# EAGLE schematic CheetahBooster (EAGLE 7.6.0)
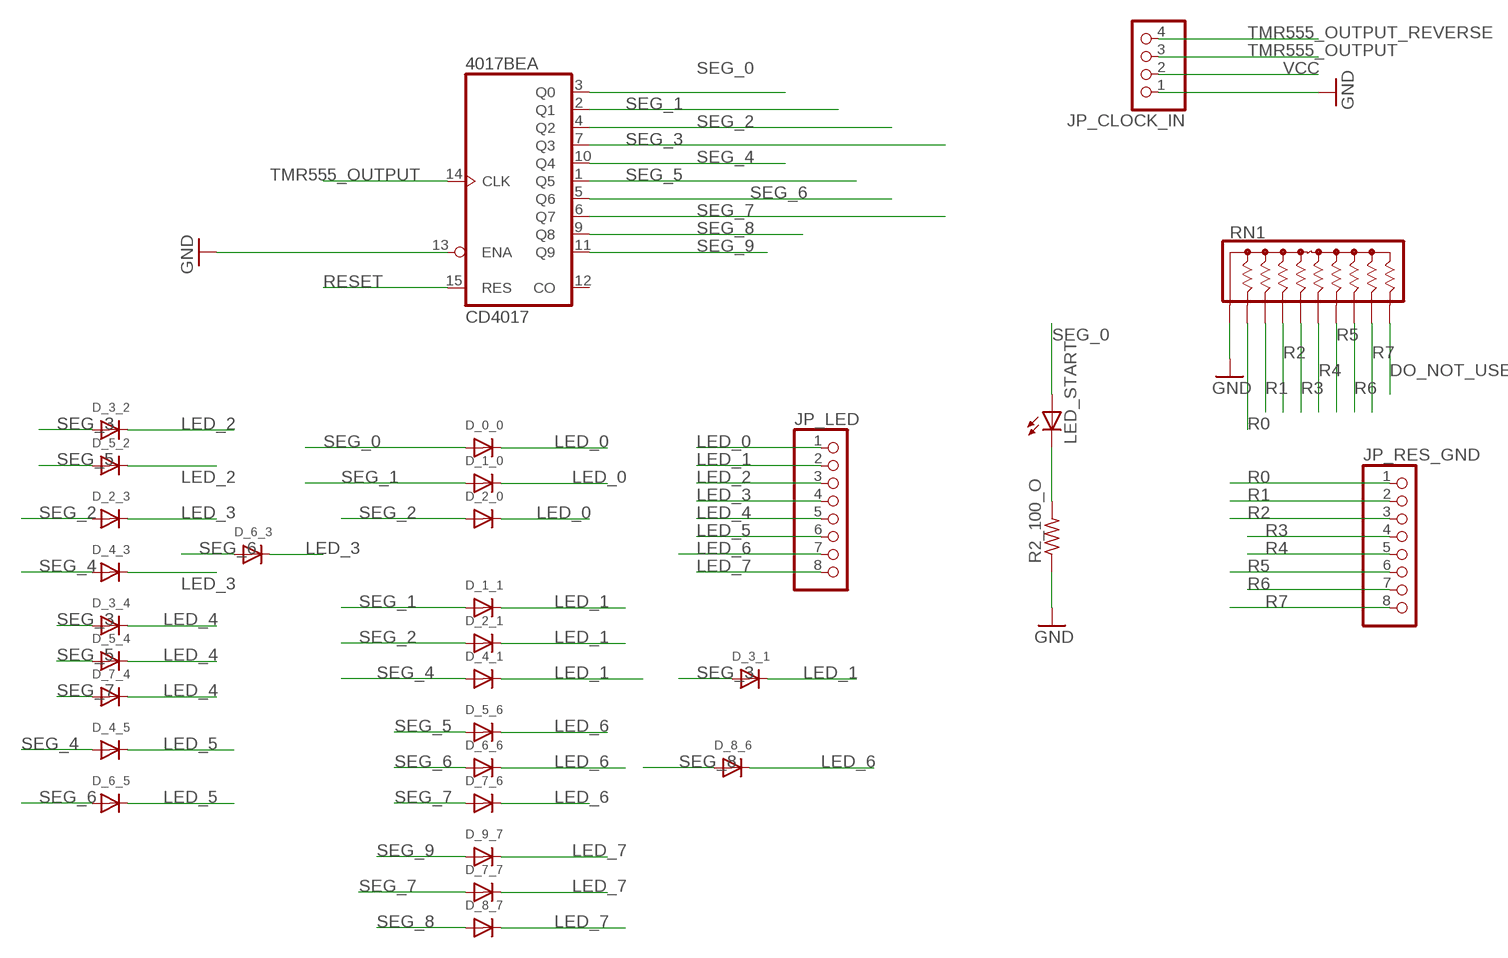
[diagram p0: schematic, sheet 1]

## Parts
4017BE  CD4017  [DIL16]
D_0_0  DIODESMA  [SMADIODE]
D_1_0  DIODESMA  [SMADIODE]
D_1_1  DIODESMA  [SMADIODE]
D_2_0  DIODESMA  [SMADIODE]
D_2_1  DIODESMA  [SMADIODE]
D_2_3  DIODESMA  [SMADIODE]
D_3_1  DIODESMA  [SMADIODE]
D_3_2  DIODESMA  [SMADIODE]
D_3_4  DIODESMA  [SMADIODE]
D_4_1  DIODESMA  [SMADIODE]
D_4_3  DIODESMA  [SMADIODE]
D_4_5  DIODESMA  [SMADIODE]
D_5_2  DIODESMA  [SMADIODE]
D_5_4  DIODESMA  [SMADIODE]
D_5_6  DIODESMA  [SMADIODE]
D_6_3  DIODESMA  [SMADIODE]
D_6_5  DIODESMA  [SMADIODE]
D_6_6  DIODESMA  [SMADIODE]
D_7_4  DIODESMA  [SMADIODE]
D_7_6  DIODESMA  [SMADIODE]
D_7_7  DIODESMA  [SMADIODE]
D_8_6  DIODESMA  [SMADIODE]
D_8_7  DIODESMA  [SMADIODE]
D_9_7  DIODESMA  [SMADIODE]
JP_CLOCK_IN  PINHD-1X4  [1X04]
JP_LED  PINHD-1X8  [1X08]
JP_RES_GND  PINHD-1X8  [1X08]
LED_START  LEDSMT1206  [1206]
R2_100_O  R-US_R1206  [R1206]
RN1  4610X  [SIP10]

## Nets
DO_NOT_USE: RN1.10
GND: 4017BE.13(A:ENA) JP_CLOCK_IN.1 R2_100_O.1 RN1.1
LED_0: D_0_0.C D_1_0.C D_2_0.C JP_LED.1
LED_1: D_1_1.C D_2_1.C D_3_1.C D_4_1.C JP_LED.2
LED_2: D_3_2.C D_5_2.C JP_LED.3
LED_3: D_2_3.C D_4_3.C D_6_3.C JP_LED.4
LED_4: D_3_4.C D_5_4.C D_7_4.C JP_LED.5
LED_5: D_4_5.C D_6_5.C JP_LED.6
LED_6: D_5_6.C D_6_6.C D_7_6.C D_8_6.C JP_LED.7
LED_7: D_7_7.C D_8_7.C D_9_7.C JP_LED.8
N$1: LED_START.C R2_100_O.2
R0: JP_RES_GND.1 RN1.2
R1: JP_RES_GND.2 RN1.3
R2: JP_RES_GND.3 RN1.4
R3: JP_RES_GND.4 RN1.5
R4: JP_RES_GND.5 RN1.6
R5: JP_RES_GND.6 RN1.7
R6: JP_RES_GND.7 RN1.8
R7: JP_RES_GND.8 RN1.9
RESET: 4017BE.15(A:RES)
SEG_0: 4017BE.3(A:Q0) D_0_0.A LED_START.A
SEG_1: 4017BE.2(A:Q1) D_1_0.A D_1_1.A
SEG_2: 4017BE.4(A:Q2) D_2_0.A D_2_1.A D_2_3.A
SEG_3: 4017BE.7(A:Q3) D_3_1.A D_3_2.A D_3_4.A
SEG_4: 4017BE.10(A:Q4) D_4_1.A D_4_3.A D_4_5.A
SEG_5: 4017BE.1(A:Q5) D_5_2.A D_5_4.A D_5_6.A
SEG_6: 4017BE.5(A:Q6) D_6_3.A D_6_5.A D_6_6.A
SEG_7: 4017BE.6(A:Q7) D_7_4.A D_7_6.A D_7_7.A
SEG_8: 4017BE.9(A:Q8) D_8_6.A D_8_7.A
SEG_9: 4017BE.11(A:Q9) D_9_7.A
TMR555_OUTPUT: 4017BE.14(A:CLK) JP_CLOCK_IN.3
TMR555_OUTPUT_REVERSE: JP_CLOCK_IN.4
VCC: JP_CLOCK_IN.2
Unconnected: 4017BE.12(A:CO)

## Power pins joined to a net without a drawn wire
GND: 4017BE.8(P:GND)
VCC: 4017BE.16(P:VCC)

## Library data of the parts
4017BE = SparkFun-DigitalIC:CD4017; PROD_ID: IC-11929
D_0_0 D_1_0 D_1_1 D_2_0 D_2_1 D_2_3 D_3_1 D_3_2 D_3_4 D_4_1 D_4_3 D_4_5 D_5_2 D_5_4 D_5_6 D_6_3 D_6_5 D_6_6 D_7_4 D_7_6 D_7_7 D_8_6 D_8_7 D_9_7 = adafruit:DIODE: Diode SMADIODE - SMA Surface Mount Package 20V 1A Schottky Diode Digikey: 641-1014-6-ND DO-1N4148 - Through Hole Small Current Diode SOD-123 20V 1 A (.5mV Vf) Schottky Diode - Digikey: MBRX120TPMSCT-ND SOD-323 10V 570mA (.38mV Vf, 3ns) Schottky Diode - Digikey: ZLLS410CT-ND SOD-523 30V 30mA Schottky Diode (RB751S-40TE61) - Digikey: RB751S-40TE61CT-ND SOT23-R/W - SOT23 Package (R = Solder Paste/Reflow Ovens, W = Hand-Soldering) BAT54Film 40V 300mA - Digikey: 497-7162-1-ND
JP_CLOCK_IN = pinhead:PINHD-1X4: PIN HEADER
JP_LED JP_RES_GND = pinhead:PINHD-1X8: PIN HEADER
LED_START = adafruit:LED: LED OSRAM: - CHIPLED LG R971, LG N971, LY N971, LG Q971, LY Q971, LO R971, LY R971 LH N974, LH R974 LS Q976, LO Q976, LY Q976 LO Q996 - Hyper CHIPLED LW Q18S LB Q993, LB Q99A, LB R99A - SideLED LS A670, LO A670, LY A670, LG A670, LP A670 LB A673, LV A673, LT A673, LW A673 LH A674 LY A675 LS A676, LA A676, LO A676, LY A676, LW A676 LS A679, LY A679, LG A679 - Hyper Micro SIDELED® LS Y876, LA Y876, LO Y876, LY Y876 LT Y87S - SmartLED LW L88C, LW L88S LB L89C, LB L89S, LG L890 LS L89K, LO L89K, LY L89K LS L896, LA L896, LO L896, LY L896 - TOPLED LS T670, LO T670, LY T670, LG T670, LP T670 LSG T670, LSP T670, LSY T670, LOP T670, LYG T670 LG T671, LOG T671, LSG T671 LB T673, LV T673, LT T673, LW T673 LH T674 LS T676, LA T676, LO T676, LY T676, LB T676, LH T676, LSB T676, LW T676 LB T67C, LV T67C, LT T67C, LS T67K, LO T67K, LY T67K, LW E67C LS E67B, LA E67B, LO E67B, LY E67B, LB E67C, LV E67C, LT E67C LW T67C LS T679, LY T679, LG T679 LS T770, LO T770, LY T770, LG T770, LP T770 LB T773, LV T773, LT T773, LW T773 LH T774 LS E675, LA E675, LY E675, LS T675 LS T776, LA T776, LO T776, LY T776, LB T776 LHGB T686 LT T68C, LB T68C - Hyper Mini TOPLED® LB M676 - Mini TOPLED Santana® LG M470 LS M47K, LO M47K, LY M47K Source: http://www.osram.convergy.de/
R2_100_O = adafruit:R-US_: RESISTOR, American symbol
RN1 = resistor-sip:4610X: Bourns 4600X Series - Thick Film Conformal SIPs 4610X-101 Resistor Network Configuration: 101 (Bussed Resistors) Resistance range: 10 ohms to 10 Megaohms Maximum Operating Voltage: 100V Source: http://www.bourns.com/ProductLine.aspx?name=standard_thick_film_networks PDF: http://www.bourns.com/data/global/pdfs/4600X.pdf